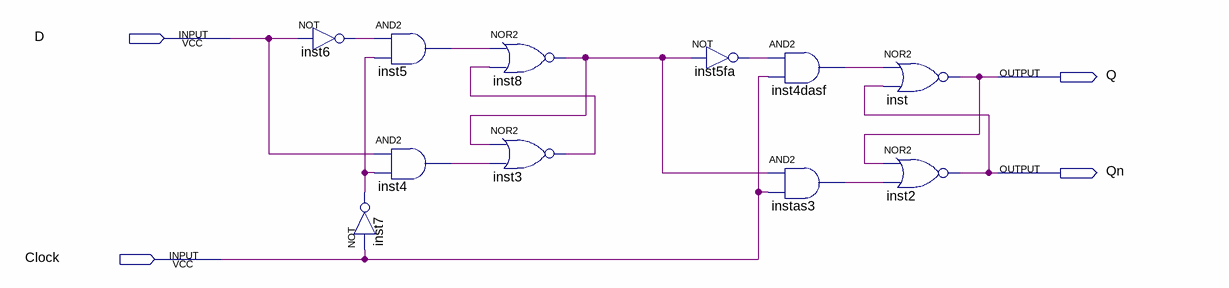
[diagram p0: schematic sheet]
// Quartus schematic FFDCS.bdf as structural Verilog: 11 symbols, 4 pins
module FFDCS (
  input  D,
  input  Clock,
  output Q,
  output Qn
);

  wire inst3_out, inst4_out, inst4dasf_out, inst5_out, inst5fa_out, inst6_out, inst7_out, inst8_out,
       instas3_out;

  not inst6 (inst6_out, D);
  not inst7 (inst7_out, Clock);
  and inst5 (inst5_out, inst6_out, inst7_out);
  and inst4 (inst4_out, D, inst7_out);
  nor inst8 (inst8_out, inst5_out, inst3_out);
  nor inst3 (inst3_out, inst8_out, inst4_out);
  not inst5fa (inst5fa_out, inst8_out);
  and inst4dasf (inst4dasf_out, inst5fa_out, Clock);
  and instas3 (instas3_out, inst8_out, Clock);
  nor inst (Q, inst4dasf_out, Qn);
  nor inst2 (Qn, Q, instas3_out);
endmodule
